# Altium schematic sheet LED_BUFFER_1xFPGA.SchDoc
size B
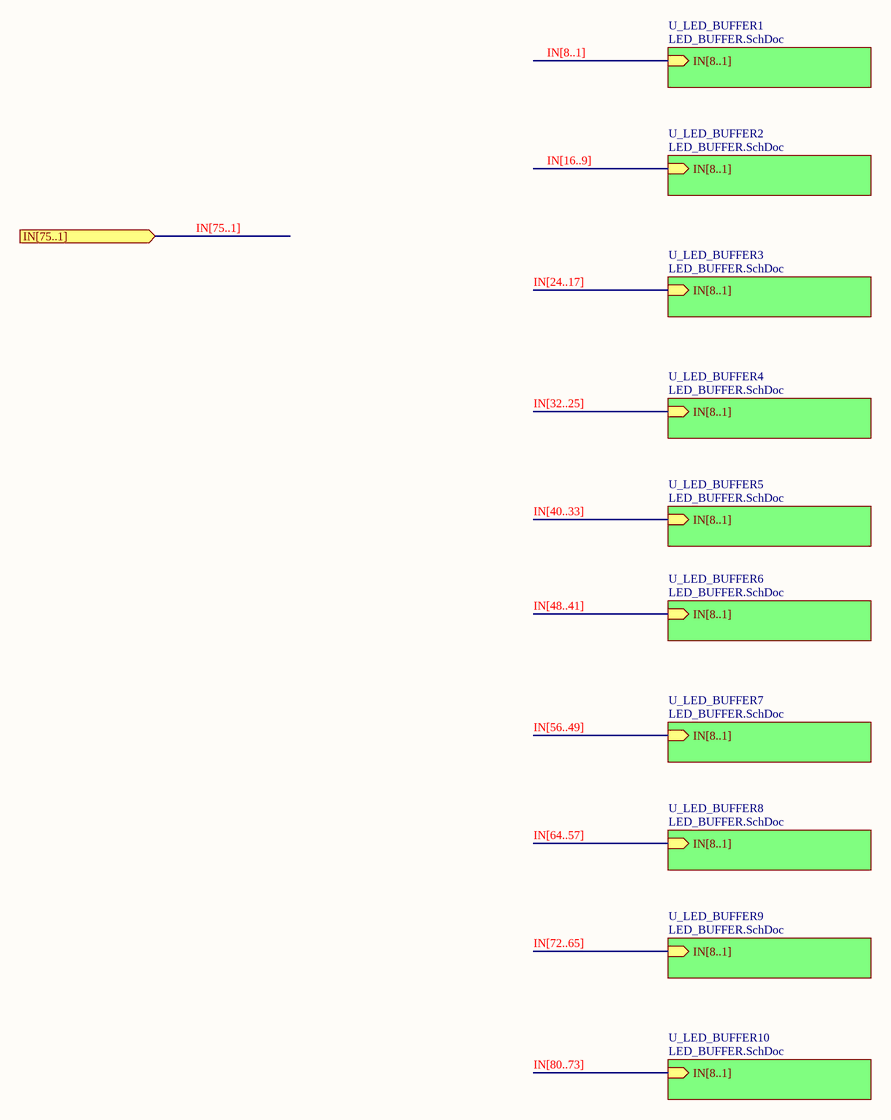
[diagram p0: LED_BUFFER_1xFPGA.SchDoc]

## Sub-sheets
U_LED_BUFFER1 = LED_BUFFER.SchDoc: IN[8..1] (in)
U_LED_BUFFER2 = LED_BUFFER.SchDoc: IN[8..1] (in)
U_LED_BUFFER3 = LED_BUFFER.SchDoc: IN[8..1] (in)
U_LED_BUFFER4 = LED_BUFFER.SchDoc: IN[8..1] (in)
U_LED_BUFFER5 = LED_BUFFER.SchDoc: IN[8..1] (in)
U_LED_BUFFER6 = LED_BUFFER.SchDoc: IN[8..1] (in)
U_LED_BUFFER7 = LED_BUFFER.SchDoc: IN[8..1] (in)
U_LED_BUFFER8 = LED_BUFFER.SchDoc: IN[8..1] (in)
U_LED_BUFFER9 = LED_BUFFER.SchDoc: IN[8..1] (in)
U_LED_BUFFER10 = LED_BUFFER.SchDoc: IN[8..1] (in)

## Ports
IN[75..1] (in)

## Buses and harness runs
bus IN[8..1] = sheet U_LED_BUFFER1/IN[8..1]
bus IN[16..9] = sheet U_LED_BUFFER2/IN[8..1]
bus IN[24..17] = sheet U_LED_BUFFER3/IN[8..1]
bus IN[32..25] = sheet U_LED_BUFFER4/IN[8..1]
bus IN[40..33] = sheet U_LED_BUFFER5/IN[8..1]
bus IN[48..41] = sheet U_LED_BUFFER6/IN[8..1]
bus IN[56..49] = sheet U_LED_BUFFER7/IN[8..1]
bus IN[64..57] = sheet U_LED_BUFFER8/IN[8..1]
bus IN[72..65] = sheet U_LED_BUFFER9/IN[8..1]
bus IN[75..1] = port IN[75..1]
bus IN[80..73] = sheet U_LED_BUFFER10/IN[8..1]